# Altium schematic sheet S10.SchDoc: IEEE-1394/Ethernet FPGA Controller
size 381 x 254 mm; Revision: 3.2; SheetNumber: 10; SheetTotal: 10
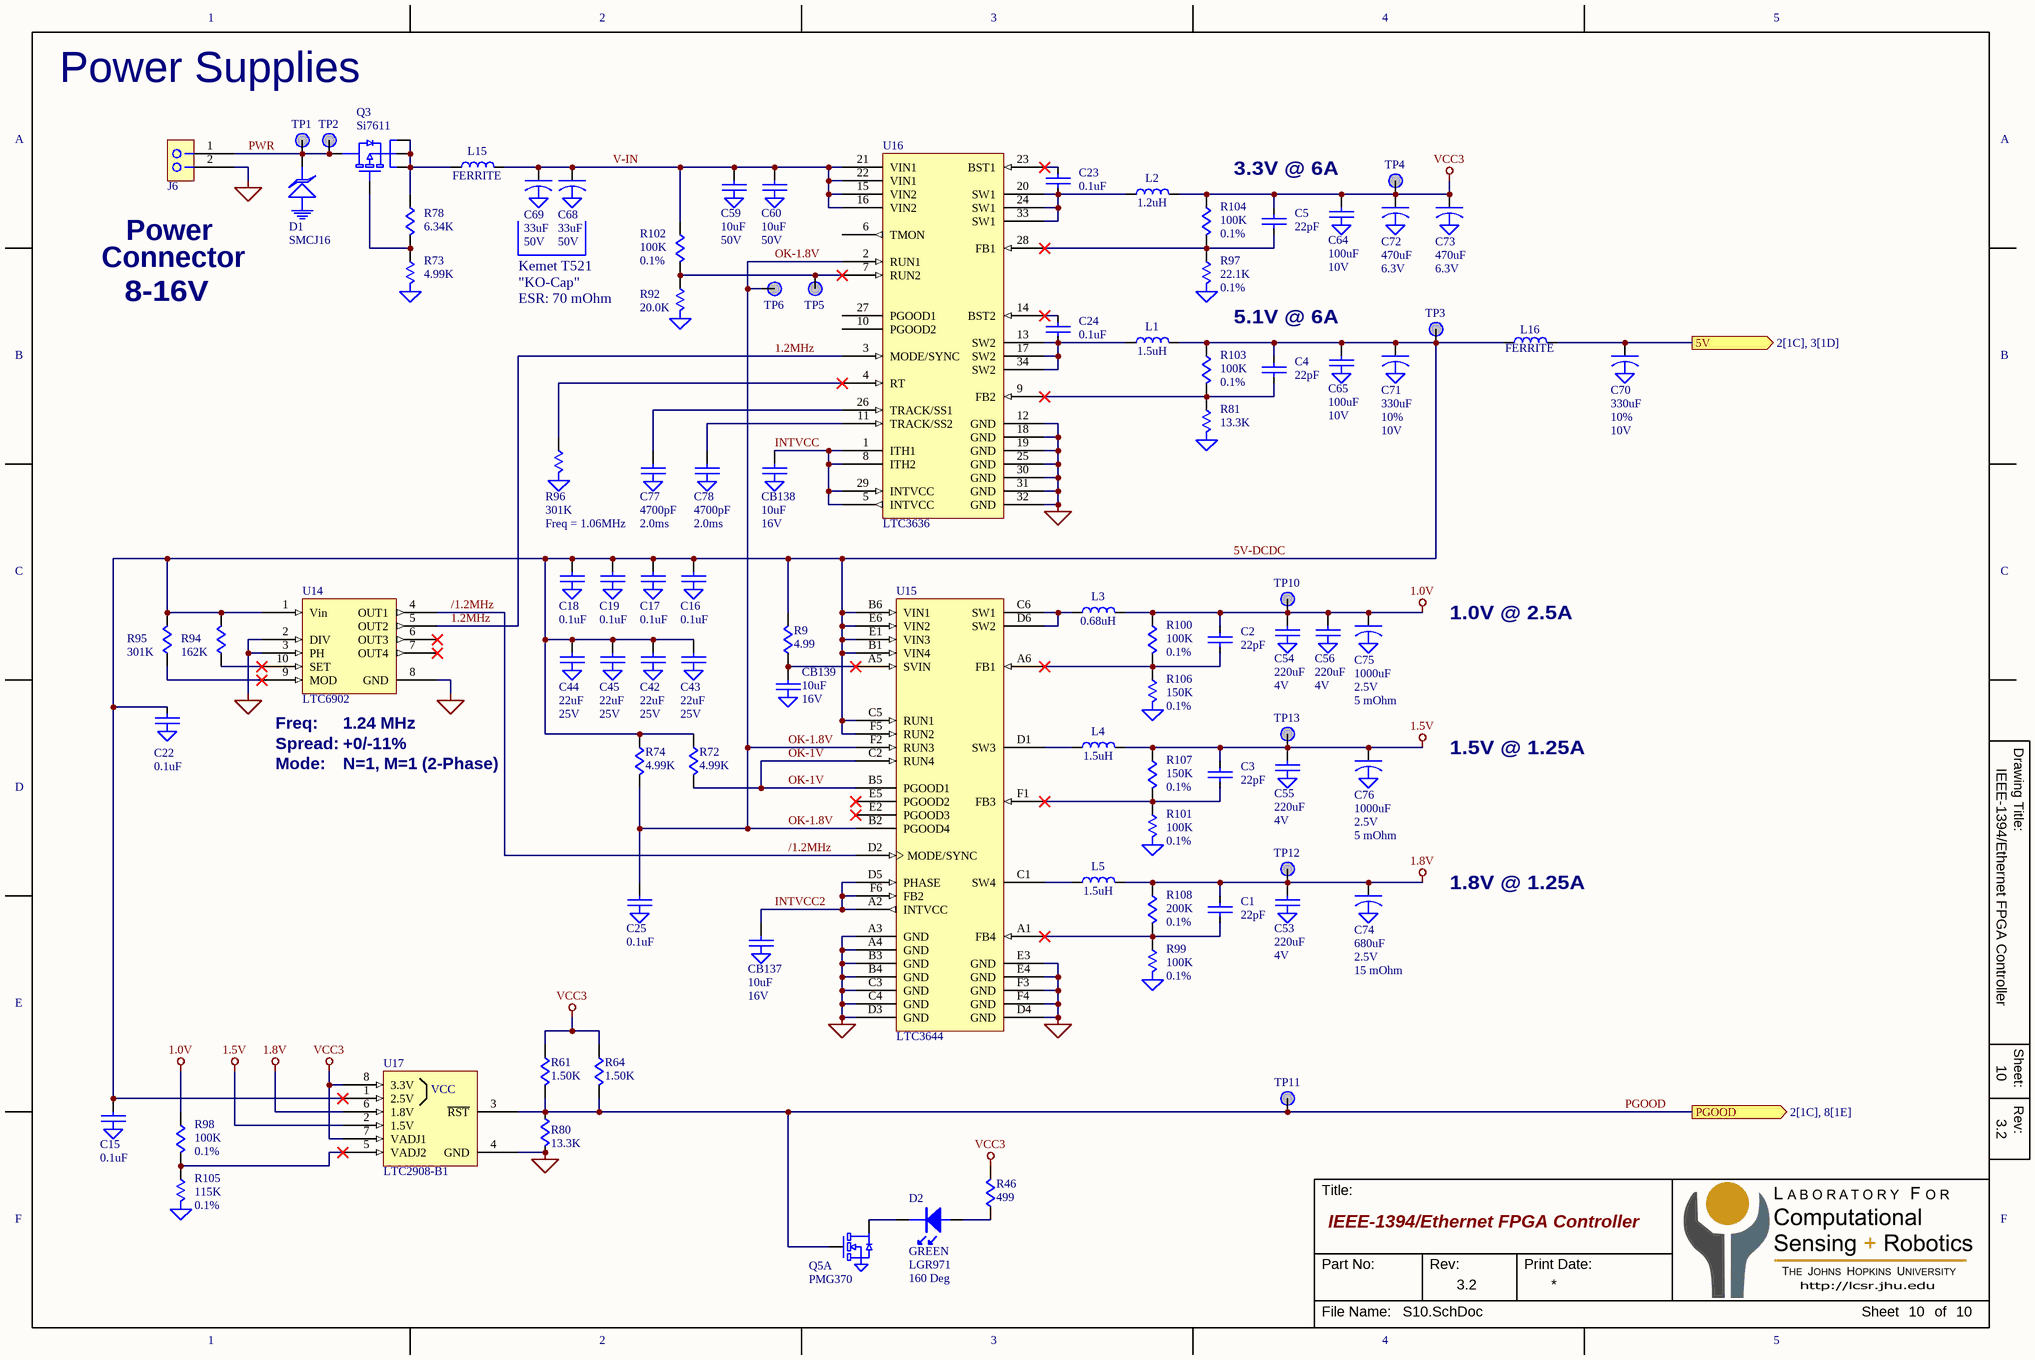
[diagram p0: S10.SchDoc]

## Parts
C1  22pF  [C0402]
C2  22pF  [C0402]
C3  22pF  [C0402]
C4  22pF  [C0402]
C5  22pF  [C0402]
C15  0.1uF  [C0402]
C16  0.1uF  [C0402]
C17  0.1uF  [C0402]
C18  0.1uF  [C0402]
C19  0.1uF  [C0402]
C22  0.1uF  [C0402]
C23  0.1uF  [C0402]
C24  0.1uF  [C0402]
C25  0.1uF  [C0402]
C42  22uF  [C0805]
C43  22uF  [C0805]
C44  22uF  [C0805]
C45  22uF  [C0805]
C53  220uF  [C1206]
C54  220uF  [C1206]
C55  220uF  [C1206]
C56  220uF  [C1206]
C59  10uF  [C1210]
C60  10uF  [C1210]
C64  100uF  [C1210]
C65  100uF  [C1210]
C68  33uF  Voltage: 50V  [CAP-D-31]
C69  33uF  Voltage: 50V  [CAP-D-31]
C70  330uF  Voltage: 10V  Tol: 10%  [CAP-D-31]
C71  330uF  Voltage: 10V  Tol: 10%  [CAP-D-31]
C72  470uF  Volts: 6.3V  [CAP-D-31]
C73  470uF  Volts: 6.3V  [CAP-D-31]
C74  680uF  Voltage: 2.5V  ESR: 15 mOhm  [CAP-D-43]
C75  1000uF  Voltage: 2.5V  ESR: 5 mOhm  [CAP-D-43]
C76  1000uF  Voltage: 2.5V  ESR: 5 mOhm  [CAP-D-43]
C77  4700pF  Parameter 1: 2.0ms  [C0402]
C78  4700pF  Parameter 1: 2.0ms  [C0402]
CB137  10uF  [CB0603]
CB138  10uF  [CB0603]
CB139  10uF  [CB0603]
D1  SMCJ16  [DIODE-SMC]
D2  Color: GREEN  P/N: LGR971  Angle: 160 Deg  [LED-0805]  (hidden comment: LED)
J6  HEADER 2  [HDR-2x1-100]  (value not drawn)
L1  1.5uH  [INDUCTOR-XGL5030]
L2  1.2uH  [INDUCTOR-XGL5030]
L3  0.68uH  [INDUCTOR-XAL4040]
L4  1.5uH  [INDUCTOR-XAL4040]
L5  1.5uH  [INDUCTOR-XAL4040]
L15  FERRITE  [R1206]
L16  FERRITE  [R1206]
Q3  Si7611  [PowerPak-1212]
Q5  PMG370  [SC70-6-NP]  (part A of 2)
R9  4.99  [R0402]
R46  499  [R0402]
R61  1.50K  [R0402]
R64  1.50K  [R0402]
R72  4.99K  [R0402]
R73  4.99K  [R0402]
R74  4.99K  [R0402]
R78  6.34K  [R0402]
R80  13.3K  [R0402]
R81  13.3K  [R0402]
R92  20.0K  [R0402]
R94  162K  [R0402]
R95  301K  [R0402]
R96  301K  Parameter 1: Freq = 1.06MHz  [R0402]
R97  22.1K  [R0402]
R98  100K  Parameter 1: 0.1%  [R0402]
R99  100K  [R0402]
R100  100K  Parameter 1: 0.1%  [R0402]
R101  100K  [R0402]
R102  100K  [R0402]
R103  100K  Parameter 1: 0.1%  [R0402]
R104  100K  Parameter 1: 0.1%  [R0402]
R105  115K  [R0402]
R106  150K  [R0402]
R107  150K  Parameter 1: 0.1%  [R0402]
R108  200K  [R0402]
TP1  PAD  [PAD25-SM]  (value not drawn)  (no BOM)
TP2  PAD  [PAD25-SM]  (value not drawn)  (no BOM)
TP3  PAD  [PAD25-SM]  (value not drawn)  (no BOM)
TP4  PAD  [PAD25-SM]  (value not drawn)  (no BOM)
TP5  PAD  [PAD25-SM]  (value not drawn)  (no BOM)
TP6  PAD  [PAD25-SM]  (value not drawn)  (no BOM)
TP10  PAD  [PAD25-SM]  (value not drawn)  (no BOM)
TP11  PAD  [PAD25-SM]  (value not drawn)  (no BOM)
TP12  PAD  [PAD25-SM]  (value not drawn)  (no BOM)
TP13  PAD  [PAD25-SM]  (value not drawn)  (no BOM)
U14  LTC6902  [MSOP-10]
U15  LTC3644  [BGA-36-08mm]
U16  LTC3636  [QFN-28-LTC3636]
U17  LTC2908-B1  [SOT-23-8]

## Ports
5V (out, see 2[1C], 3[1D]), PGOOD (out, see 2[1C], 8[1E])

## Nets
1.0V: C2.1 C54.1 C56.1 C75.1 L3.2 R98.1 R100.1 TP10.1
1.5V: C3.1 C55.1 C76.1 L4.2 R107.1 TP13.1 U17.2(1.5V)
1.8V: C1.1 C53.1 C74.1 L5.2 R108.1 TP12.1 U17.6(1.8V)
GND: C15.2(GND) C16.2(GND) C17.2(GND) C18.2(GND) C19.2(GND) C22.2(GND) C25.2(GND) C42.2(GND) C43.2(GND) C44.2(GND) C45.2(GND) C53.2(GND) C54.2(GND) C55.2(GND) C56.2(GND) C59.2(GND) C60.2(GND) C64.2(GND) C65.2(GND) C68.2(GND) C69.2(GND) C70.2(GND) C71.2(GND) C72.2(GND) C73.2(GND) C74.2(GND) C75.2(GND) C76.2(GND) C77.2(GND) C78.2(GND) CB137.2(GND) CB138.2(GND) CB139.2(GND) D1.2(GND) J6.2 Q5.1(S1) R73.2(GND) R80.2 R81.2(GND) R92.2(GND) R96.2(GND) R97.2(GND) R99.2(GND) R101.2(GND) R105.2(GND) R106.2(GND) U14.2(DIV) U14.3(PH) U14.8(GND) U15.A3(GND) U15.A4(GND) U15.B3(GND) U15.B4(GND) U15.C3(GND) U15.C4(GND) U15.D3(GND) U15.D4(GND) U15.E3(GND) U15.E4(GND) U15.F3(GND) U15.F4(GND) U16.12(GND) U16.18(GND) U16.19(GND) U16.25(GND) U16.30(GND) U16.31(GND) U16.32(GND) U17.4(GND)
VCC3: C5.1 C64.1 C72.1 C73.1 L2.2 R46.2 R61.1 R64.1 R104.1 TP4.1 U17.7(VADJ1) U17.8(3.3V)
1.2MHz: U14.5(OUT2) U16.3(MODE/SYNC)
5V: C70.1 L16.2 ; port 5V
5V-DCDC: C4.1 C15.1 C16.1 C17.1 C18.1 C19.1 C22.1 C42.1 C43.1 C44.1 C45.1 C65.1 C71.1 L1.2 L16.1 R9.2 R72.1 R74.1 R94.2 R95.2 R103.1 TP3.1 U14.1(Vin) U15.B1(VIN4) U15.B6(VIN1) U15.C5(RUN1) U15.E1(VIN3) U15.E6(VIN2) U15.F5(RUN2) U17.1(2.5V)
/1.2MHz: U14.4(OUT1) U15.D2(MODE/SYNC)
INTVCC: CB138.1 U16.1(ITH1) U16.5(INTVCC) U16.8(ITH2) U16.29(INTVCC)
INTVCC2: CB137.1 U15.A2(INTVCC) U15.D5(PHASE) U15.F6(FB2)
OK-1.8V: C25.1 R74.2 TP6.1 U15.B2(PGOOD4) U15.F2(RUN3) U16.2(RUN1)
OK-1V: R72.2 U15.B5(PGOOD1) U15.C2(RUN4)
PGOOD: Q5.2(G1) R61.2 R64.2 R80.1 TP11.1 U17.3(~{RST}) ; port PGOOD
PWR: D1.1 J6.1 Q3.5(D) TP1.1 TP2.1
V-IN: C59.1 C60.1 C68.1 C69.1 L15.2 R102.1 U16.15(VIN2) U16.16(VIN2) U16.21(VIN1) U16.22(VIN1)
NetC1_2: C1.2 R99.1 R108.2 U15.A1(FB4)
NetC2_2: C2.2 R100.2 R106.1 U15.A6(FB1)
NetC3_2: C3.2 R101.1 R107.2 U15.F1(FB3)
NetC4_2: C4.2 R81.1 R103.2 U16.9(FB2)
NetC5_2: C5.2 R97.1 R104.2 U16.28(FB1)
NetC23_1: C23.1 U16.23(BST1)
NetC23_2: C23.2 L2.1 U16.20(SW1) U16.24(SW1) U16.33(SW1)
NetC24_1: C24.1 U16.14(BST2)
NetC24_2: C24.2 L1.1 U16.13(SW2) U16.17(SW2) U16.34(SW2)
NetC77_1: C77.1 U16.26(TRACK/SS1)
NetC78_1: C78.1 U16.11(TRACK/SS2)
NetCB139_1: CB139.1 R9.1 U15.A5(SVIN)
NetD2_1: D2.1(C) Q5.6(D1)
NetD2_2: D2.2(A) R46.1
NetL3_1: L3.1 U15.C6(SW1) U15.D6(SW2)
NetL4_1: L4.1 U15.D1(SW3)
NetL5_1: L5.1 U15.C1(SW4)
NetL15_1: L15.1 Q3.1(S) Q3.2(S) Q3.3(S) R78.1
NetQ3_4: Q3.4(G) R73.1 R78.2
NetR92_1: R92.1 R102.2 TP5.1 U16.7(RUN2)
NetR94_1: R94.1 U14.10(SET)
NetR95_1: R95.1 U14.9(MOD)
NetR96_1: R96.1 U16.4(RT)
NetR98_2: R98.2 R105.1 U17.5(VADJ2)

Not connected (* = marked no-connect by the designer): U14 6(OUT3)* 7(OUT4)*; U15 E2(PGOOD3)* E5(PGOOD2)*; U16 6(TMON) 10(PGOOD2) 27(PGOOD1)

## Notes on the sheet
- Power Supplies
- 3.3V @ 6A
- 8-16V
- (near J6) Power
- Connector
- Kemet T521
- ESR: 70 mOhm
- "KO-Cap"
- 5.1V @ 6A
- 1.0V @ 2.5A
- (near U14) Freq:
- Spread:
- Mode:
- (near U14) 1.24 MHz
- +0/-11%
- N=1, M=1 (2-Phase)
- 1.5V @ 1.25A
- 1.8V @ 1.25A
- 1
- 2
- 3
- 4
- 5
- A
- B
- C
- Drawing Title:
- D
- E
- Sheet:
- Rev:
- F
- Title:
- Part No:
- Print Date:
- File Name:
- Sheet
- of
- (in symbol CAP-GND) 4V; 25V; 16V; 10V; 50V
- (in symbol LTC2908-B1-SOT) VCC
- (in symbol R) 0.1%
- (in symbol R-GND) 0.1%

## Library data of the parts
C1-C5 C23 C24 = CAP
C15-C19 C22 C25 C42-C45 C53-C56 C59 C60 C64 C65 C77 C78 CB137-CB139 = CAP-GND
C68 C69 = CAP-POL-GND: Type: Tant
C70 C71 = CAP-POL-GND: Type: SpeedPower
C72 C73 = CAP-POL-GND
C74-C76 = CAP-POL-GND: Part #: Kemet: T530X158M2R5ATE005
D1 = TVS-GND
L1-L5 L15 L16 = INDUCTOR
Q3 = MOSFET-P-PPACK
Q5 = MOSFET-N-DUAL6
R9 R46 R61 R64 R72 R74 R78 R80 R94 R95 R98 R100 R102-R104 R107 R108 = R
R73 R81 R92 R96 R97 R99 R101 R105 R106 = R-GND
U17 = LTC2908-B1-SOT